# Altium schematic sheet Schematic.schdoc
size 429 x 272 mm
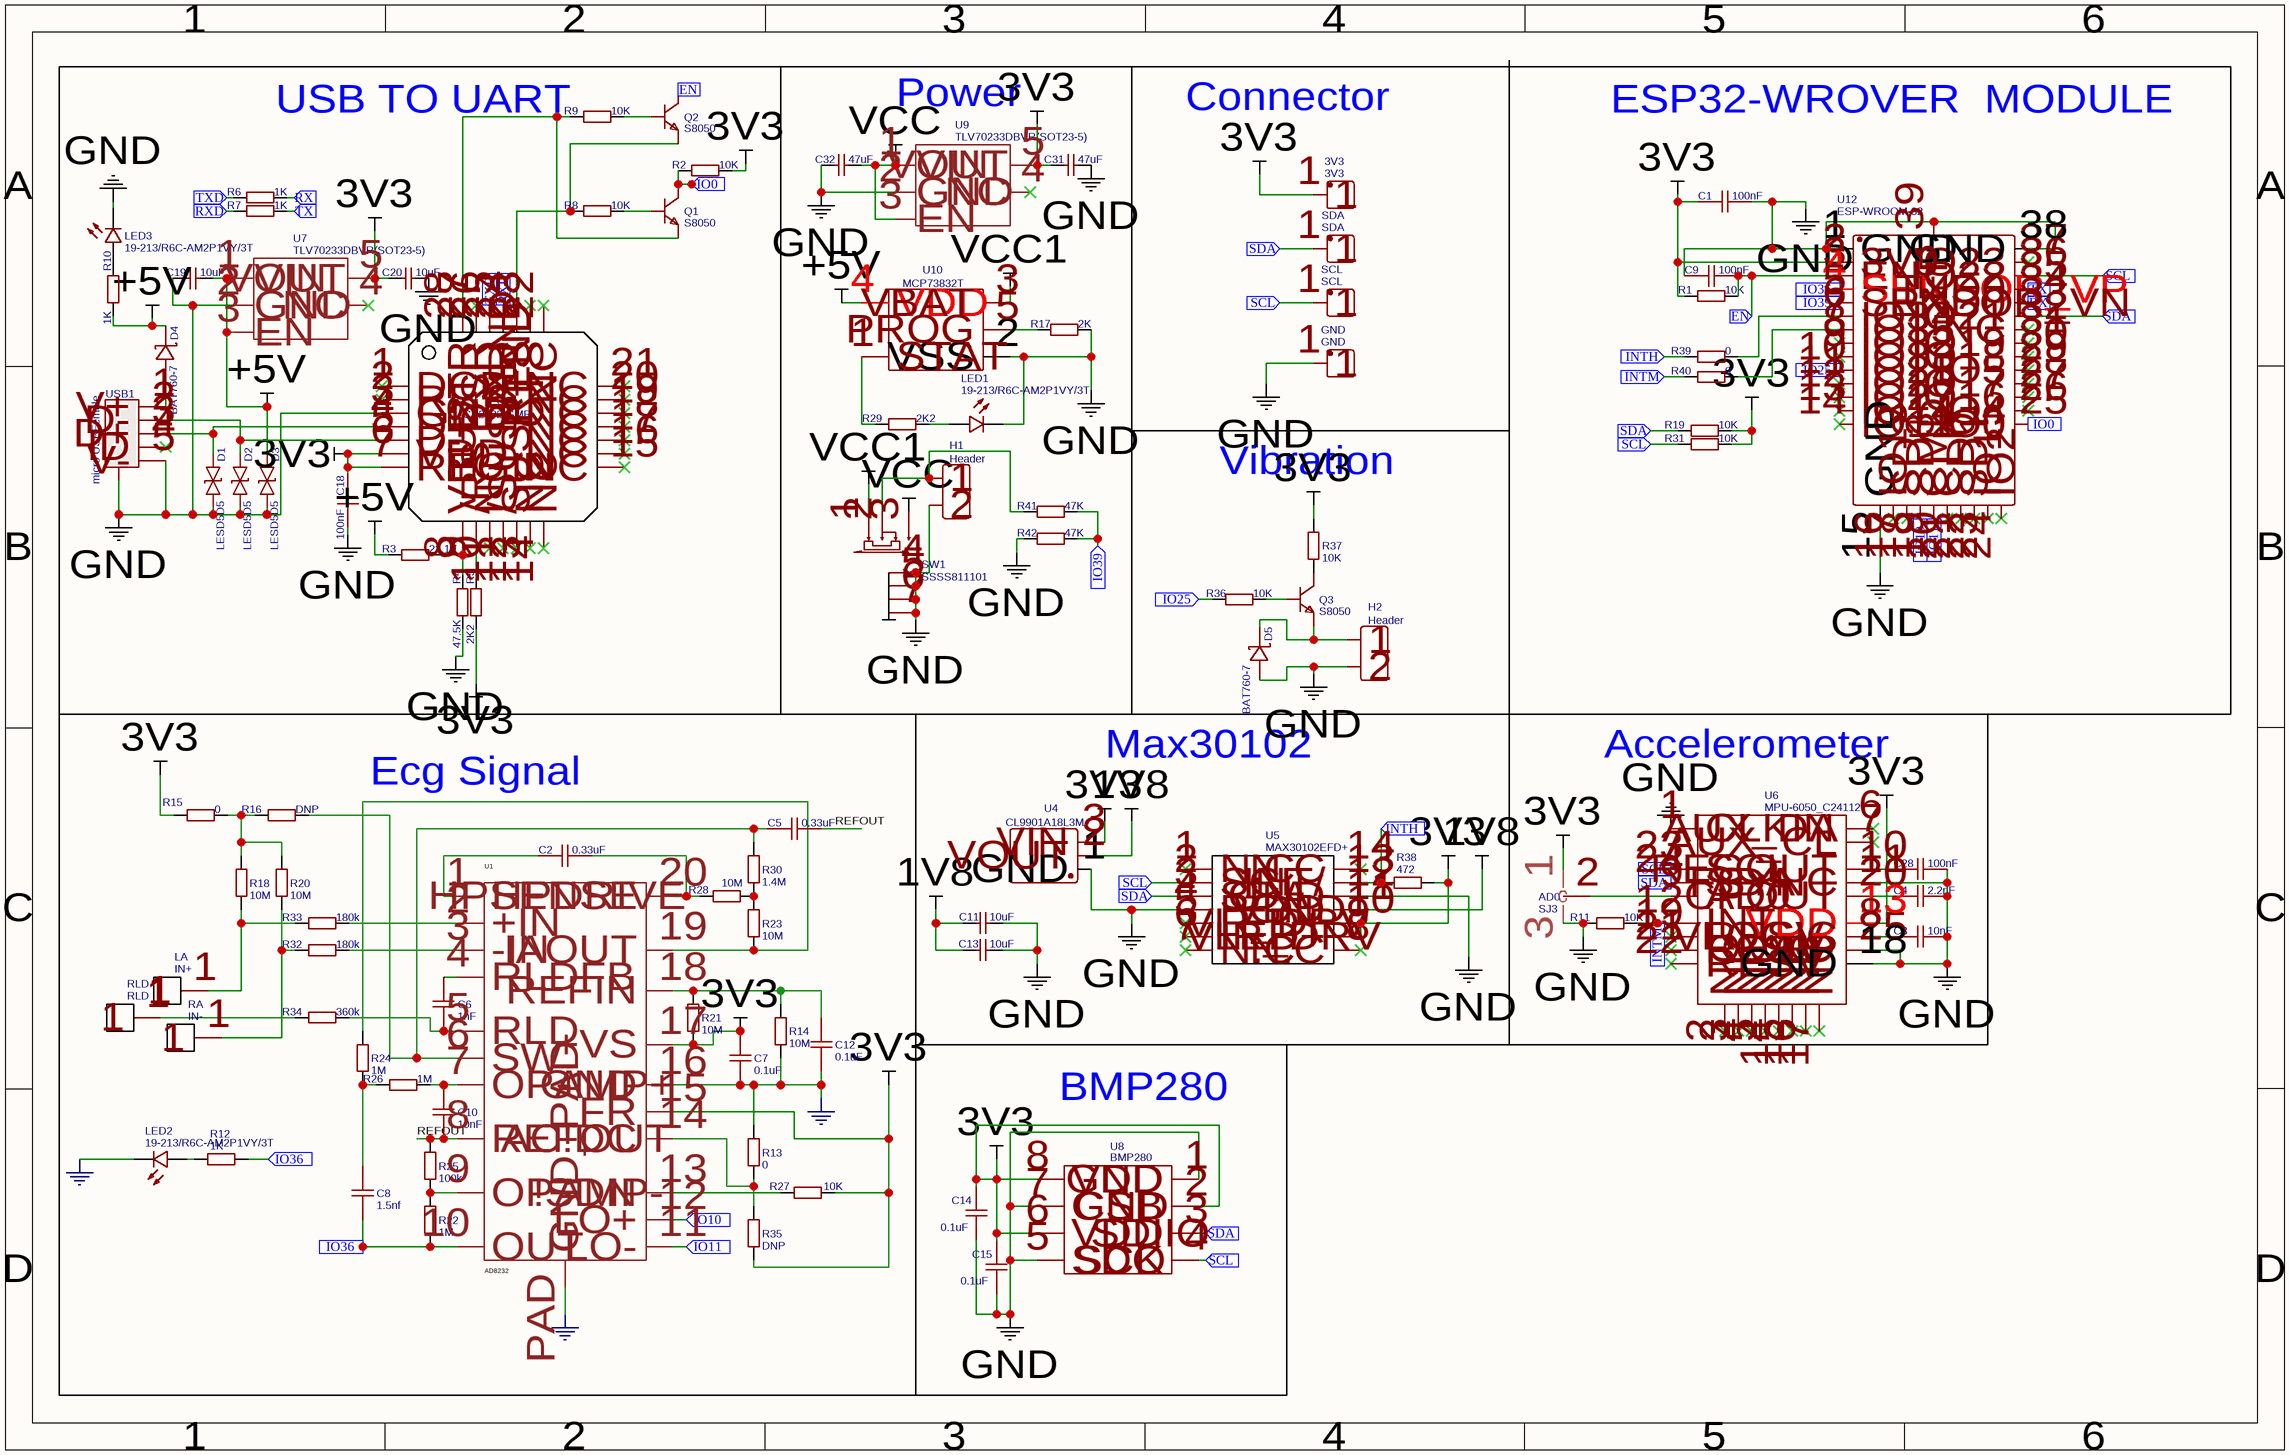
[diagram p0: Schematic.schdoc]

## Parts
3V3  3V3  [HDR-TH_1P-P2.54-V-M]
AD0  SJ3  [SJ3]
C1  100nF  [0402]
C2  0.33uF  [0402]
C3  10nF  [0402]
C4  2.2nF  [0402]
C5  0.33uF  [0402]
C6  1nF  [0402]
C7  0.1uF  [0402]
C8  1.5nf  [0402]
C9  100nF  [0402]
C10  10nF  [0402]
C11  10uF  [0603]
C12  0.1uF  [0402]
C13  10uF  [0603]
C14  0.1uF  [0402]
C15  0.1uF  [0402]
C18  100nF  [0402]
C19  10uF  [0603]
C20  10uF  [0603]
C28  100nF  [0402]
C31  47uF  [0603]
C32  47uF  [0603]
D1  LESD5D5  [LESD5D50CT1G]
D2  LESD5D5  [LESD5D50CT1G]
D3  LESD5D5  [LESD5D50CT1G]
D4  BAT760-7  [SOD-323_L1.8-W1.3-LS2.5-RD]
D5  BAT760-7  [SOD-323_L1.8-W1.3-LS2.5-RD]
GND  GND  [HDR-TH_1P-P2.54-V-M]
H1  Header  [HDR-2X1/2.54]
H2  Header  [HDR-2X1/2.54]
LA  IN+  [PIN HEADER]
LED1  19-213/R6C-AM2P1VY/3T  [LED-0603]
LED2  19-213/R6C-AM2P1VY/3T  [LED-0603]
LED3  19-213/R6C-AM2P1VY/3T  [LED-0603]
Q1  S8050  [SOT-23(SOT-23-3)]
Q2  S8050  [SOT-23(SOT-23-3)]
Q3  S8050  [SOT-23(SOT-23-3)]
R1  10K  [0402]
R2  10K  [0402]
R3  22.1K  [0402]
R4  47.5K  [0402]
R5  2K2  [0402]
R6  1K  [0402]
R7  1K  [0402]
R8  10K  [0402]
R9  10K  [0402]
R10  1K  [0402]
R11  10K  [0402]
R12  1K  [0402]
R13  0  [0402]
R14  10M  [0402]
R15  0  [0402]
R16  DNP  [0402]
R17  2K  [0402]
R18  10M  [0402]
R19  10K  [0402]
R20  10M  [0402]
R21  10M  [0402]
R22  1M  [0402]
R23  10M  [0402]
R24  1M  [0402]
R25  100k  [0402]
R26  1M  [0402]
R27  10K  [0402]
R28  10M  [0402]
R29  2K2  [0402]
R30  1.4M  [0402]
R31  10K  [0402]
R32  180k  [0402]
R33  180k  [0402]
R34  360k  [0402]
R35  DNP  [0402]
R36  10K  [0402]
R37  10K  [0402]
R38  472  [0402]
R39  0  [0402]
R40  0  [0402]
R41  47K  [0402]
R42  47K  [0402]
RA  IN-  [PIN HEADER]
RLD  RLD  [PIN HEADER]
SCL  SCL  [HDR-TH_1P-P2.54-V-M]
SDA  SDA  [HDR-TH_1P-P2.54-V-M]
SW1  SSSS811101  [SSSS811101]
U1  AD8232  [LFCSP_20]
U2  CP2102-GMR  [QFN-28_5X5X05P]
U4  CL9901A18L3M  [SOT-23_L2.9-W1.3-P0.95-LS2.4-BR]
U5  MAX30102EFD+  [MAX30102]
U6  MPU-6050_C24112  [QFN-24_4X4X05P]
U7  TLV70233DBVR(SOT23-5)  [SEEED-SOT-23-5]
U8  BMP280  [BMP280_D]
U9  TLV70233DBVR(SOT23-5)  [SEEED-SOT-23-5]
U10  MCP73832T  [SOT23-5]
U12  ESP-WROOM-32  [ESP-WROOM-32]
USB1  micro USBFemale  [MICRO-USB-1]

## Blocks framed on the sheet
Ecg Signal: C2 C5-C8 C10 C12 LA LED2 R12-R16 R18 R20-R28 R30 R32-R35 RA RLD U1

## Ports
EN (in), INTH (in), INTM (in), IO0 (in), IO10 (in), IO11 (in), IO25 (in), IO36 (in), IO39 (in), RX (in), RXD (in), SCL (in), SDA (in), TX (in), TXD (in)

## Nets
1V8: C11.1 C13.1 U4.2(VOUT) U5.11(VDD)
3V3: 3V3.1 AD0.1 C1.2 C7.2 C14.1 C15.1 C18.1 C20.2 C31.2 R1.1 R2.1 R5.1 R15.1 R19.2 R21.1 R27.1 R31.2 R35.2 R37.2 R38.1 U1.15(FR) U1.17(+VS) U2.6(VDD) U2.7(REGIN) U4.3(VIN) U5.9(VLED+) U5.10(VLED+) U6.13(VDD) U7.5(VOUT) U8.2(CSB) U8.6(VDDIO) U8.8(VDD) U9.5(VOUT) U12.2(3V3)
+5V: C19.1 D3.2(A) D4.1 R3.1 R10.1 U7.1(VIN) U7.3(EN) U10.4(VDD)
GND: AD0.3 C1.1 C3.2 C4.2 C7.1 C9.2 C11.2 C12.1 C13.2 C14.2 C15.2 C18.2 C19.2 C20.1 C28.2 C31.1 C32.2 D1.1(K) D2.1(K) D3.1(K) D5.2 GND.1 H1.2 H2.2 LED1.2(C) LED2.2(C) LED3.2(C) R4.1 R11.1 R13.2 R14.1 R17.2 R42.1 SW1.4 SW1.5 SW1.6 SW1.7 U1.16(GND) U1.PAD(GND_PAD) U2.3(GND) U4.1(GND) U5.4(PGND) U5.12(GND) U6.1(CLKIN) U6.11(FSYNC) U6.18(GND) U6.25(EP) U7.2(GND) U8.1(GND) U8.5(SDO) U8.7(GND) U9.2(GND) U10.2(VSS) U12.1(GND) U12.15(GND) U12.38(GND) U12.39(EP) USB1.0(MTN) USB1.5(V-)
VCC: C32.1 SW1.3 U9.1(VIN) U9.3(EN)
VCC1: SW1.1 U10.3(VBAT)
EN: C9.1 Q2.3(C) R1.2 U12.3(EN) ; port EN
INTH: R38.2 R39.1 U5.13(INT/) ; port INTH
INTM: R11.2 R40.1 U6.12(INT) ; port INTM
IO0: Q1.3(C) R2.2 U12.25(IO0) ; port IO0
IO10: U1.12(LO+) U12.18(SD3) ; port IO10
IO11: U1.11(LO-) U12.19(CMD) ; port IO11
IO25: R36.1 U12.10(IO25) ; port IO25
IO36: C8.1 R12.1 R22.1 U1.10(OUT) U12.4(SENSOR_VP) ; port IO36
IO39: R41.2 R42.2 U12.5(SENSOR_VN) ; port IO39
REFOUT: C5.2 C10.1 R25.2 U1.8(REFOUT)
RX: R6.2 U12.34(RXD0) ; port RX
RXD: R7.1 U2.25(RXD) ; port RXD
SCL: R31.1 SCL.1 U5.2(SCL) U6.23(SCL) U8.4(SCK) U12.36(IO22) ; port SCL
SDA: R19.1 SDA.1 U5.3(SDA) U6.24(SDA) U8.3(SDI) U12.33(IO21) ; port SDA
TX: R7.2 U12.35(TXD0) ; port TX
TXD: R6.1 U2.26(TXD) ; port TXD
NetAD0_2: AD0.2 U6.9(AD0)
NetC2_1: C2.1 U1.1(HPDRIVE)
NetC2_2: C2.2 R28.2 U1.20(HPSENSE)
NetC3_1: C3.1 U6.8(VLOGIC)
NetC4_1: C4.1 U6.20(CPOUT)
NetC5_1: C5.1 R16.2 R30.2 U1.6(SW)
NetC6_1: C6.1 R34.2 U1.5(RLD)
NetC6_2: C6.2 U1.4(RLDFB)
NetC8_2: C8.2 R24.1 R26.1
NetC10_2: C10.2 R26.2 U1.7(OPAMP+)
NetC12_2: C12.2 R14.2 R21.2 U1.18(REFIN)
NetC28_1: C28.1 U6.10(REGOUT)
NetD1_2: D1.2(A) U2.4(D+) USB1.3(D+)
NetD2_2: D2.2(A) U2.5(D-) USB1.2(D-)
NetD4_2: D4.2 USB1.1(V+)
NetD5_1: D5.1 H2.1 Q3.2(E)
NetH1_1: H1.1 R41.1 SW1.2
NetLA_1: LA.1 R18.1 R33.1
NetLED1_1: LED1.1(A) R29.2
NetLED2_1: LED2.1(A) R12.2
NetLED3_1: LED3.1(A) R10.2
NetQ1_1: Q1.1(B) R8.2
NetQ1_2: Q1.2(E) R9.1 U2.28(DTR)
NetQ2_1: Q2.1(B) R9.2
NetQ2_2: Q2.2(E) R8.1 U2.24(RTS)
NetQ3_1: Q3.1(B) R36.2
NetQ3_3: Q3.3(C) R37.1
NetR3_2: R3.2 R4.2 U2.8(VBUS)
NetR5_2: R5.2 U2.9(/RST)
NetR13_1: R13.1 R35.1 U1.14(AC!DC)
NetR15_2: R15.2 R16.1 R18.2 R20.2
NetR17_1: R17.1 U10.5(PROG)
NetR20_1: R20.1 R32.1 RA.1
NetR22_2: R22.2 R25.1 U1.9(OPAMP-)
NetR23_1: R23.1 R24.2 U1.19(IAOUT)
NetR23_2: R23.2 R28.1 R30.1
NetR27_2: R27.2 U1.13(!SDN)
NetR29_1: R29.1 U10.1(STAT)
NetR32_2: R32.2 U1.3(-IN)
NetR33_2: R33.2 U1.2(+IN)
NetR34_1: R34.1 RLD.1
NetR39_2: R39.2 U12.6(IO34)
NetR40_2: R40.2 U12.7(IO35)

Not connected (* = marked no-connect by the designer): U2 1(DCD)* 2(RI)* 10(NC)* 11(/SUSPEND)* 12(SUSPEND)* 13(NC)* 14(NC)* 15(NC)* 16(NC)* 17(NC)* 18(NC)* 19(NC)* 20(NC)* 21(NC)* 22(NC)* 23(CTS)* 27(DSR)*; U5 1(N.C)* 5(R_DRV)* 6(IR_DRV)* 7(N.C)* 8(N.C)* 14(N.C)*; U6 2(NC)* 3(NC)* 4(NC)* 5(NC)* 6(AUX_DA)* 7(AUX_CL)* 14(NC)* 15(NC)* 16(NC)* 17(NC)* 19(RESV)* 21(RESV)* 22(RESV)*; U7 4(NC)*; U9 4(NC)*; U12 8(IO32)* 9(IO33)* 11(IO26)* 12(IO27)* 13(IO14)* 14(IO12)* 16(IO13)* 17(SD2)* 20(CLK)* 21(SD0)* 22(SD1)* 23(IO15)* 24(IO2)* 26(IO4)* 27(IO16)* 28(IO17)* 29(IO5)* 30(IO18)* 31(IO19)* 32(NC)* 37(IO23)*; USB1 4(ID)*

## Notes on the sheet
- USB TO UART
- Power
- Connector
- ESP32-WROVER  MODULE
- (near R37) Vibration
- Max30102
- Accelerometer
- BMP280

## Library data of the parts
3V3 = 3V3: BOM_Manufacturer: Amphenol ICC; BOM_Manufacturer Part: 78511-400HLF; Contributor: LCSC; BOM_Supplier: LCSC; BOM_Supplier Part: C213446; spicePre: U; spiceSymbolName: 78511-400HLF
AD0 = SJ3: Contributor: dhruvchikhaliya12; spicePre: S; spiceSymbolName: SJ3
C1 C9 C18 C28 = 100nF: BOM_Manufacturer: MuRata; BOM_Manufacturer Part: GRM155R71C104KA88D; nameAlias: Capacitance; BOM_Supplier: LCSC; BOM_Supplier Part: C71629; spicePre: C; spiceSymbolName: GRM155R71C104KA88D
C2 C5 = 0.33uF: BOM_Manufacturer: MuRata; BOM_Manufacturer Part: GRM155R71C104KA88D; nameAlias: Capacitance; BOM_Supplier: LCSC; BOM_Supplier Part: C71629; spicePre: C; spiceSymbolName: GRM155R71C104KA88D
C3 C10 = 10nF: BOM_Manufacturer: MuRata; BOM_Manufacturer Part: GRM155R71C104KA88D; nameAlias: Capacitance; BOM_Supplier: LCSC; BOM_Supplier Part: C71629; spicePre: C; spiceSymbolName: GRM155R71C104KA88D
C4 = 2.2nF: BOM_Manufacturer: MuRata; BOM_Manufacturer Part: GRM155R71C104KA88D; nameAlias: Capacitance; BOM_Supplier: LCSC; BOM_Supplier Part: C71629; spicePre: C; spiceSymbolName: GRM155R71C104KA88D
C6 = 1nF: BOM_Manufacturer: MuRata; BOM_Manufacturer Part: GRM155R71C104KA88D; nameAlias: Capacitance; BOM_Supplier: LCSC; BOM_Supplier Part: C71629; spicePre: C; spiceSymbolName: GRM155R71C104KA88D
C7 C12 C14 C15 = 0.1uF: BOM_Manufacturer: MuRata; BOM_Manufacturer Part: GRM155R71C104KA88D; nameAlias: Capacitance; BOM_Supplier: LCSC; BOM_Supplier Part: C71629; spicePre: C; spiceSymbolName: GRM155R71C104KA88D
C8 = 1.5nf: BOM_Manufacturer: MuRata; BOM_Manufacturer Part: GRM155R71C104KA88D; nameAlias: Capacitance; BOM_Supplier: LCSC; BOM_Supplier Part: C71629; spicePre: C; spiceSymbolName: GRM155R71C104KA88D
C11 C13 C19 C20 = 10uF: BOM_Manufacturer: TAIYO YUDEN; BOM_Manufacturer Part: UMK107AB7105KA-T; nameAlias: Capacitance; Contributor: LCSC; BOM_Supplier: LCSC; BOM_Supplier Part: C105174; spicePre: C; spiceSymbolName: UMK107AB7105KA-T
C31 C32 = 47uF: BOM_Manufacturer: TAIYO YUDEN; BOM_Manufacturer Part: UMK107AB7105KA-T; nameAlias: Capacitance; Contributor: LCSC; BOM_Supplier: LCSC; BOM_Supplier Part: C105174; spicePre: C; spiceSymbolName: UMK107AB7105KA-T
D1-D3 = LESD5D5: Contributor: AmmoNyte Systems; spicePre: D
D4 D5 = BAT760-7: BOM_Manufacturer: DIODES; Contributor: LCSC; SMT Type: Extend; BOM_Supplier: LCSC; BOM_Manufacturer Part: BAT760-7; BOM_Supplier Part: C124187; BOM_LCSC Assembly: Yes; spicePre: D
GND = GND: BOM_Manufacturer: Amphenol ICC; BOM_Manufacturer Part: 78511-400HLF; Contributor: LCSC; BOM_Supplier: LCSC; BOM_Supplier Part: C213446; spicePre: U; spiceSymbolName: 78511-400HLF
H1 H2 = Header: BOM_Manufacturer: TE Connectivity; BOM_Manufacturer Part: 826629-2; Contributor: joel1977garcia; BOM_Supplier: LCSC; image: //image.lceda.cn/szlcsc/C86471.jpg; BOM_Supplier Part: C86471; spicePre: H
LA = IN+: Contributor: dhruvchikhaliya12; spicePre: U; spiceSymbolName: Male Header
LED1-LED3 = 19-213/R6C-AM2P1VY/3T: BOM_Manufacturer: Everlight Elec; Contributor: LCSC; BOM_Supplier: LCSC; BOM_Supplier Part: C128052; BOM_Manufacturer Part: 19-213/R6C-AM2P1VY/3T; spicePre: L
Q1-Q3 = S8050: BOM_Manufacturer: CJ; SMT Type: Basic; BOM_Supplier: LCSC; BOM_Manufacturer Part: S8050; image: //image.lceda.cn/szlcsc/C2146.jpg; BOM_Supplier Part: C2146; BOM_LCSC Assembly: Yes; spicePre: Q
R1 R2 R8 R9 R11 R19 R27 R31 R36 R37 = 10K: BOM_Manufacturer: YAGEO; BOM_Manufacturer Part: RC0402JR-07100KL; nameAlias: Resistance (Ohms); BOM_Supplier: LCSC; BOM_Supplier Part: C106234; spicePre: R; spiceSymbolName: RC0402JR-07100KL
R3 = 22.1K: BOM_Manufacturer: YAGEO; BOM_Manufacturer Part: RC0402JR-07100KL; nameAlias: Resistance (Ohms); BOM_Supplier: LCSC; BOM_Supplier Part: C106234; spicePre: R; spiceSymbolName: RC0402JR-07100KL
R4 = 47.5K: BOM_Manufacturer: YAGEO; BOM_Manufacturer Part: RC0402JR-07100KL; nameAlias: Resistance (Ohms); BOM_Supplier: LCSC; BOM_Supplier Part: C106234; spicePre: R; spiceSymbolName: RC0402JR-07100KL
R5 R29 = 2K2: BOM_Manufacturer: YAGEO; BOM_Manufacturer Part: RC0402JR-07100KL; nameAlias: Resistance (Ohms); BOM_Supplier: LCSC; BOM_Supplier Part: C106234; spicePre: R; spiceSymbolName: RC0402JR-07100KL
R6 R7 R10 R12 = 1K: BOM_Manufacturer: YAGEO; BOM_Manufacturer Part: RC0402JR-07100KL; nameAlias: Resistance (Ohms); BOM_Supplier: LCSC; BOM_Supplier Part: C106234; spicePre: R; spiceSymbolName: RC0402JR-07100KL
R13 R15 R39 R40 = 0: BOM_Manufacturer: YAGEO; BOM_Manufacturer Part: RC0402JR-07100KL; nameAlias: Resistance (Ohms); BOM_Supplier: LCSC; BOM_Supplier Part: C106234; spicePre: R; spiceSymbolName: RC0402JR-07100KL
R14 R18 R20 R21 R23 R28 = 10M: BOM_Manufacturer: YAGEO; BOM_Manufacturer Part: RC0402JR-07100KL; nameAlias: Resistance (Ohms); BOM_Supplier: LCSC; BOM_Supplier Part: C106234; spicePre: R; spiceSymbolName: RC0402JR-07100KL
R16 R35 = DNP: BOM_Manufacturer: YAGEO; BOM_Manufacturer Part: RC0402JR-07100KL; nameAlias: Resistance (Ohms); BOM_Supplier: LCSC; BOM_Supplier Part: C106234; spicePre: R; spiceSymbolName: RC0402JR-07100KL
R17 = 2K: BOM_Manufacturer: YAGEO; BOM_Manufacturer Part: RC0402JR-07100KL; nameAlias: Resistance (Ohms); BOM_Supplier: LCSC; BOM_Supplier Part: C106234; spicePre: R; spiceSymbolName: RC0402JR-07100KL
R22 R24 R26 = 1M: BOM_Manufacturer: YAGEO; BOM_Manufacturer Part: RC0402JR-07100KL; nameAlias: Resistance (Ohms); BOM_Supplier: LCSC; BOM_Supplier Part: C106234; spicePre: R; spiceSymbolName: RC0402JR-07100KL
R25 = 100k: BOM_Manufacturer: YAGEO; BOM_Manufacturer Part: RC0402JR-07100KL; nameAlias: Resistance (Ohms); BOM_Supplier: LCSC; BOM_Supplier Part: C106234; spicePre: R; spiceSymbolName: RC0402JR-07100KL
R30 = 1.4M: BOM_Manufacturer: YAGEO; BOM_Manufacturer Part: RC0402JR-07100KL; nameAlias: Resistance (Ohms); BOM_Supplier: LCSC; BOM_Supplier Part: C106234; spicePre: R; spiceSymbolName: RC0402JR-07100KL
R32 R33 = 180k: BOM_Manufacturer: YAGEO; BOM_Manufacturer Part: RC0402JR-07100KL; nameAlias: Resistance (Ohms); BOM_Supplier: LCSC; BOM_Supplier Part: C106234; spicePre: R; spiceSymbolName: RC0402JR-07100KL
R34 = 360k: BOM_Manufacturer: YAGEO; BOM_Manufacturer Part: RC0402JR-07100KL; nameAlias: Resistance (Ohms); BOM_Supplier: LCSC; BOM_Supplier Part: C106234; spicePre: R; spiceSymbolName: RC0402JR-07100KL
R38 = 472: BOM_Manufacturer: YAGEO; BOM_Manufacturer Part: RC0402JR-07100KL; nameAlias: Resistance (Ohms); BOM_Supplier: LCSC; BOM_Supplier Part: C106234; spicePre: R; spiceSymbolName: RC0402JR-07100KL
R41 R42 = 47K: BOM_Manufacturer: YAGEO; BOM_Manufacturer Part: RC0402JR-07100KL; nameAlias: Resistance (Ohms); BOM_Supplier: LCSC; BOM_Supplier Part: C106234; spicePre: R; spiceSymbolName: RC0402JR-07100KL
RA = IN-: Contributor: dhruvchikhaliya12; spicePre: U; spiceSymbolName: Male Header
RLD = RLD: Contributor: dhruvchikhaliya12; spicePre: U; spiceSymbolName: Male Header
SCL = SCL: BOM_Manufacturer: Amphenol ICC; BOM_Manufacturer Part: 78511-400HLF; Contributor: LCSC; BOM_Supplier: LCSC; BOM_Supplier Part: C213446; spicePre: U; spiceSymbolName: 78511-400HLF
SDA = SDA: BOM_Manufacturer: Amphenol ICC; BOM_Manufacturer Part: 78511-400HLF; Contributor: LCSC; BOM_Supplier: LCSC; BOM_Supplier Part: C213446; spicePre: U; spiceSymbolName: 78511-400HLF
SW1 = SSSS811101: BOM_Manufacturer: ALPS; BOM_Supplier: LCSC; BOM_Manufacturer Part: SSSS811101; BOM_Supplier Part: C109335; spicePre: S
U2 = CP2102-GMR: BOM_Manufacturer: SILICON LABS; SMT Type: Basic; BOM_Supplier: LCSC; BOM_Manufacturer Part: CP2102-GMR; BOM_LCSC Assembly: Yes; image: //image.lceda.cn/szlcsc/C6568.jpg; BOM_Supplier Part: C6568; spicePre: U
U4 = CL9901A18L3M: BOM_Manufacturer: CHIPLINK; Contributor: LCSC; SMT Type: Extend; BOM_Supplier: LCSC; BOM_Manufacturer Part: CL9901A18L3M; BOM_Supplier Part: C181914; BOM_JLCPCB SMD: Yes; spicePre: U; spiceSymbolName: CL9901A18L3M
U5 = MAX30102EFD+: Contributor: nitneuq; BOM_Manufacturer Part: MAX30102EFD+; BOM_Supplier Part: MAX30102EFD+-ND; BOM_Supplier: Digi-Key; link: https://datasheets.maximintegrated.com/en/ds/MAX30102.pdf; spicePre: U; spiceSymbolName: MAX30102EFD+
U6 = MPU-6050_C24112: BOM_Manufacturer: InvenSense; sourceId: 1T5FDZYC8; SMT Type: Basic; timeStamp: 1462265206; BOM_Supplier: LCSC; BOM_Manufacturer Part: MPU-6050; BOM_LCSC Assembly: Yes; image: //image.lceda.cn/szlcsc/C24112.jpg; BOM_Supplier Part: C24112; spicePre: U
U7 U9 = TLV70233DBVR(SOT23-5): description: SMD IC PMIC; sourceId: yEasmEVd7; timeStamp: 1459590366; BOM_Supplier Part: 310030033; BOM_Supplier: SeeedStudio; BOM_Manufacturer Part: TLV70233; spicePre: U
U8 = BMP280: BOM_Manufacturer: Bosch; SMT Type: Extend; BOM_Supplier: LCSC; BOM_Manufacturer Part: BMP280; BOM_Supplier Part: C83291; BOM_JLCPCB SMD: Yes; spicePre: U; spiceSymbolName: BMP280
U10 = MCP73832T: description: Miniature Single-Cell, Fully Integrated Li-Ion, Li-Polymer Charge Management Controller, 4.2V, 5-Pin SOT-23, Industrial Temperature, Tape and Reel; Contributor: ismifaizul; spicePre: U
U12 = ESP-WROOM-32: BOM_Manufacturer: ESPRESSIF; BOM_Supplier: LCSC; BOM_Manufacturer Part: ESP-WROOM-32; BOM_Supplier Part: C95209; spicePre: U
USB1 = micro USBFemale: BOM_Manufacturer: ValuePro; BOM_Supplier: LCSC; BOM_Manufacturer Part: micro USBFemale; image: //image.lceda.cn/szlcsc/C10418.jpg; BOM_Supplier Part: C10418; spicePre: U